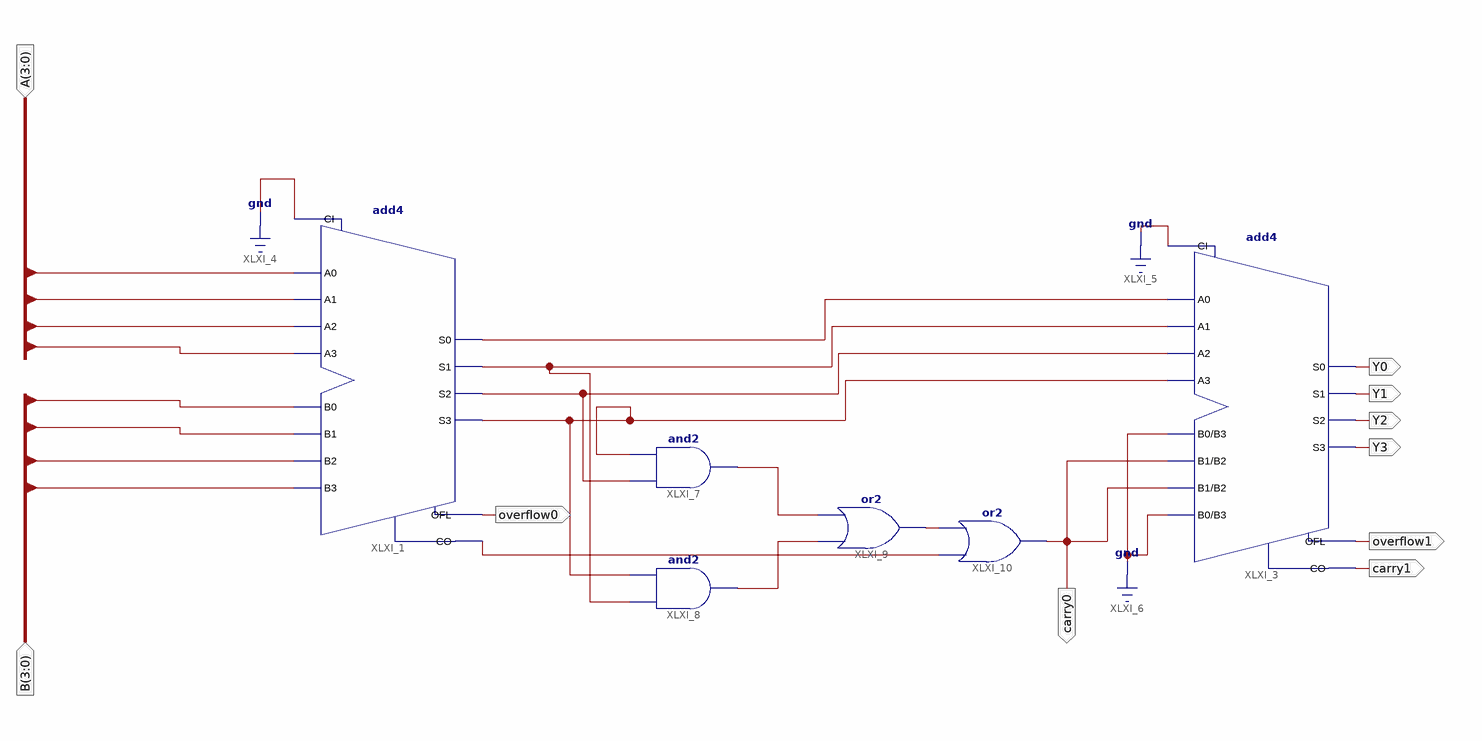
[diagram p0: schematic sheet 1]
// Xilinx ISE schematic sch2.sch (xc9500xl) as structural Verilog: 6 symbols, 10 ports
module sch2 (
  input  [3:0] A,
  input  [3:0] B,
  output overflow0,
  output overflow1,
  output carry1,
  output Y3,
  output Y2,
  output Y1,
  output Y0,
  output carry0
);

  wire XLXN_20, XLXN_21, XLXN_38, XLXN_39, XLXN_41, XLXN_43, XLXN_45, XLXN_46;

  add4 XLXI_1 (
    .A0(A[0]), .A1(A[1]), .A2(A[2]), .A3(A[3]), .B0(B[0]), .B1(B[1]), .B2(B[2]), .B3(B[3]), .CI(1'b0),
    .CO(XLXN_43), .OFL(overflow0), .S0(XLXN_20), .S1(XLXN_21), .S2(XLXN_45), .S3(XLXN_46));
  add4 XLXI_3 (
    .A0(XLXN_20), .A1(XLXN_21), .A2(XLXN_45), .A3(XLXN_46), .B0(1'b0), .B1(carry0), .B2(carry0), .B3(1'b0),
    .CI(1'b0), .CO(carry1), .OFL(overflow1), .S0(Y0), .S1(Y1), .S2(Y2), .S3(Y3));
  and XLXI_7 (XLXN_38, XLXN_45, XLXN_46);
  and XLXI_8 (XLXN_39, XLXN_21, XLXN_46);
  or XLXI_9 (XLXN_41, XLXN_39, XLXN_38);
  or XLXI_10 (carry0, XLXN_43, XLXN_41);
endmodule
